# EAGLE design ar1020 (EAGLE 7.3.0)
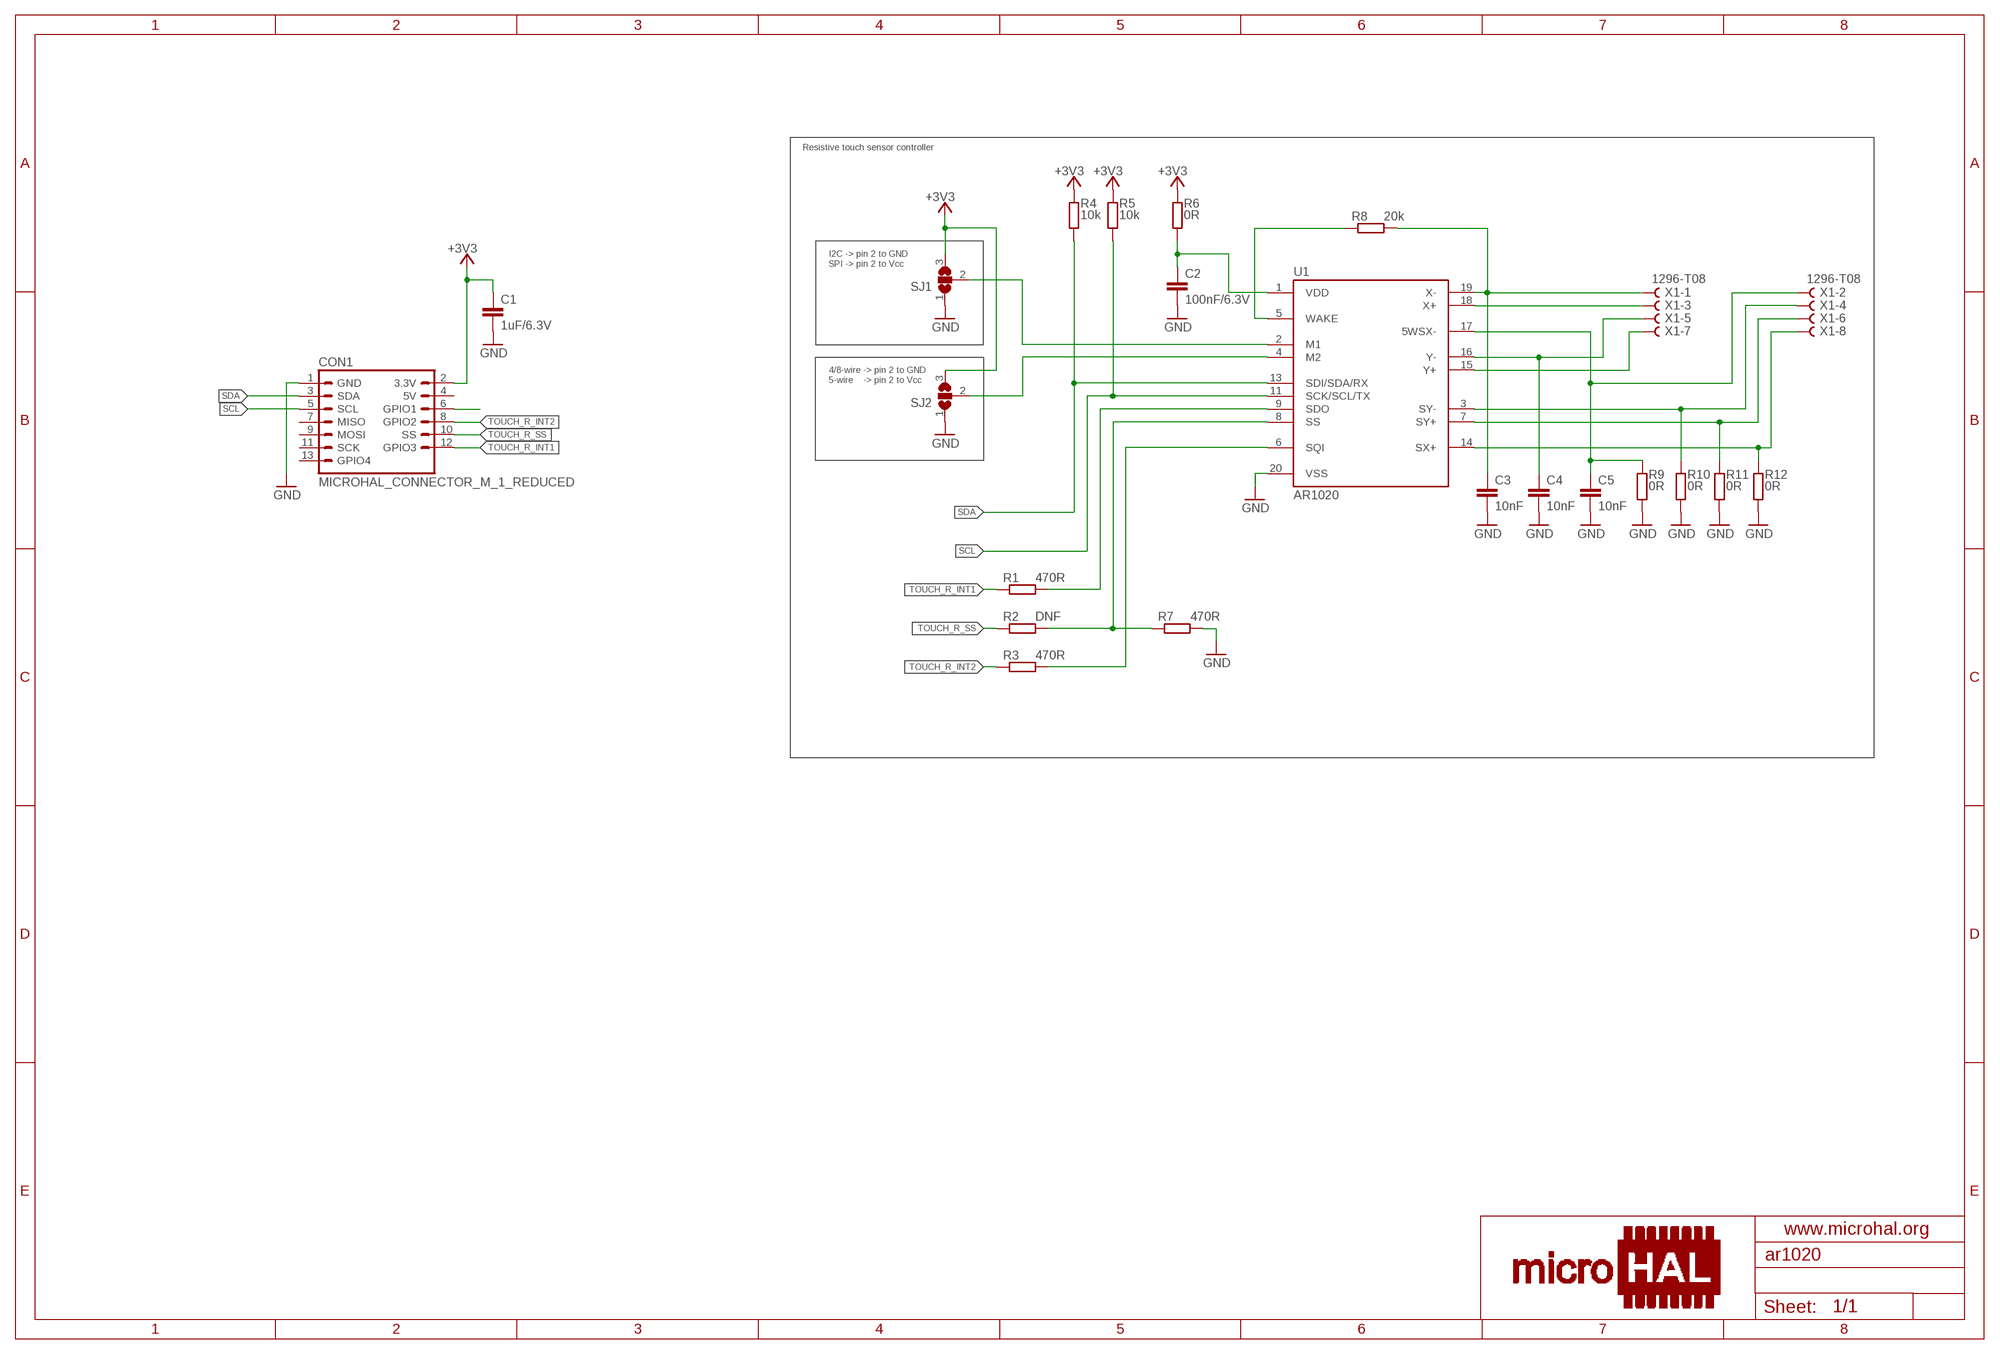
[diagram p0: schematic, sheet 1]

## Parts
C1  1uF/6.3V  C-EUC0603K  [C0603K]
C2  100nF/6.3V  C-EUC0603K  [C0603K]
C3  10nF  C-EUC0603K  [C0603K]
C4  10nF  C-EUC0603K  [C0603K]
C5  10nF  C-EUC0603K  [C0603K]
CON1  MICROHAL_CONNECTOR_M_1_REDUCED  [MICROHAL_CONNECTOR_M_1_REDUCED_EDGE]
R1  470R  R-EU_R0603  [R0603]
R2  DNF  R-EU_R0603  [R0603]
R3  470R  R-EU_R0603  [R0603]
R4  10k  R-EU_R0603  [R0603]
R5  10k  R-EU_R0603  [R0603]
R6  0R  R-EU_R0603  [R0603]
R7  470R  R-EU_R0603  [R0603]
R8  20k  R-EU_R0603  [R0603]
R9  0R  R-EU_R0603  [R0603]
R10  0R  R-EU_R0603  [R0603]
R11  0R  R-EU_R0603  [R0603]
R12  0R  R-EU_R0603  [R0603]
SJ1  SJ2W  [SJ_2]
SJ2  SJ2W  [SJ_2]
U1  AR1020  [SSOP20]
X1  1296-T08  [1296-08]

## Nets
+3V3: C1.1 CON1.2(3.3V) R4.1 R5.1 R6.1 SJ1.3 SJ2.3
GND: C1.2 C2.2 C3.2 C4.2 C5.2 CON1.1(GND) R7.1 R9.2 R10.2 R11.2 R12.2 SJ1.1 SJ2.1 U1.20(VSS)
N$1: SJ1.2 U1.2(M1)
N$2: SJ2.2 U1.4(M2)
N$3: CON1.6(GPIO1)
N$35: C2.1 R6.2 U1.1(VDD)
N$36: R8.2 U1.5(WAKE)
N$37: C3.1 R8.1 U1.19(X-) X1.1
N$38: C4.1 U1.16(Y-) X1.5
N$39: C5.1 R9.1 U1.17(5WSX-) X1.2
N$40: U1.18(X+) X1.3
N$41: U1.15(Y+) X1.7
N$42: R10.1 U1.3(SY-) X1.4
N$43: R11.1 U1.7(SY+) X1.6
N$44: R12.1 U1.14(SX+) X1.8
N$50: R1.1 U1.9(SDO)
N$51: R2.1 R7.2 U1.8(SS)
N$52: R3.1 U1.6(SQI)
SCL: CON1.5(SCL) R5.2 U1.11(SCK/SCL/TX)
SDA: CON1.3(SDA) R4.2 U1.13(SDI/SDA/RX)
TOUCH_R_INT1: CON1.12(GPIO3) R1.2
TOUCH_R_INT2: CON1.8(GPIO2) R3.2
TOUCH_R_SS: CON1.10(SS) R2.2
Unconnected: CON1.4(5V) CON1.7(MISO) CON1.9(MOSI) CON1.11(SCK) CON1.13(GPIO4)

## Notes on the sheet
- Resistive touch sensor controller
- I2C -> pin 2 to GND
  SPI -> pin 2 to Vcc
- 4/8-wire -> pin 2 to GND
  5-wire    -> pin 2 to Vcc

## Library data of the parts
C1-C5 = rcl:C-EU: CAPACITOR, European symbol
CON1 = microhal-connector_v0.1:MICROHAL_CONNECTOR_M_1_REDUCED
R1-R12 = rcl:R-EU_: RESISTOR, European symbol
SJ1 SJ2 = jumper:SJ2W: SMD solder JUMPER
U1 = AR1020:AR1020
X1 = con-leotronics:1296-T08: 1.27mm SINGLE ROW FEMALE SOCKET Source: http://www.leotronics.co.uk/Conexcon/Data%20Sheets/sec.%20A/1296ing.pdf; OC_FARNELL: unknown; OC_NEWARK: unknown

## Board
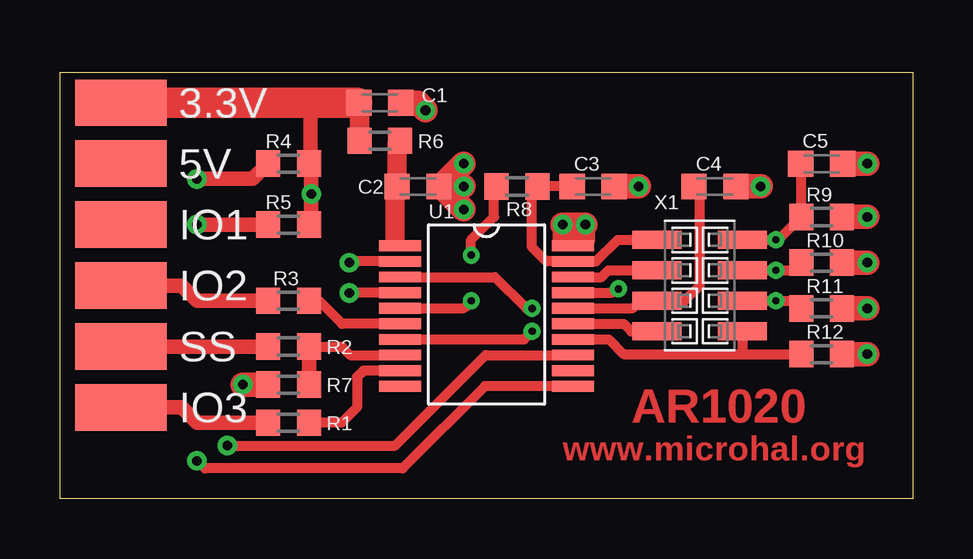
[diagram p1: board, top side]
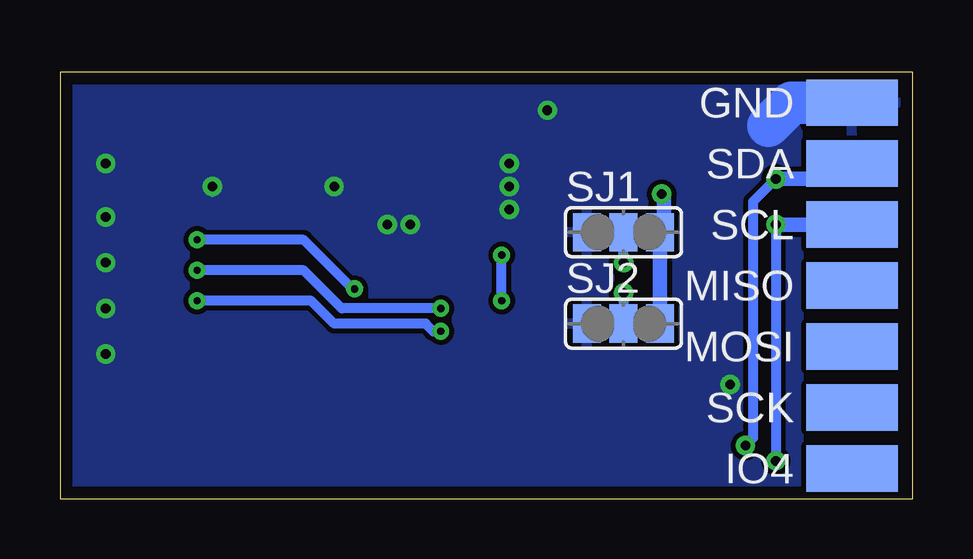
[diagram p2: board, bottom side, seen from below]

Size 35.56 x 17.78 mm. Coordinates in mm from the lower left corner, seen from the top.
Outline: 0,17.78 35.56,17.78 35.56,0 0,0 0,17.78
Copper layers (1*16): Top 0.035mm / dielectric 1.5mm / Bottom 0.035mm
Design rules "default *": minimum track width 8mil, minimum drill 11mil, track to track 8mil, track to pad 6mil, pad to pad 8mil, via to via 8mil, smd to smd 8mil, copper to edge 20mil, drill to drill 8mil, minimum pad ring 10mil, minimum via ring 8mil, stop-mask expansion 4mil, vias tented up to drill 0mil, thermal gap 10mil

### Footprints (pad centres in the part's own frame; a part is rotated, then mirrored left to right if it is on the bottom)
C0603K = smd 1.05 x 1.08: 1 -0.875,0; 2 0.875,0
MICROHAL_CONNECTOR_M_1_REDUCED_EDGE = smd 1.93 x 3.81 bottom: 1 -7.62,0; 3 -5.08,0; 5 -2.54,0; 7 0,0; 9 2.54,0; 11 5.08,0; 13 7.62,0 | smd 1.93 x 3.81: 2 -7.62,0; 4 -5.08,0; 6 -2.54,0; 8 0,0; 10 2.54,0; 12 5.08,0
R0603 = smd 1 x 1.1: 1 -0.85,0; 2 0.85,0
SJ_2 = smd 1.168 x 1.6: 1 -1.524,0; 2 0,0; 3 1.524,0
SSOP20 = smd 0.45 x 1.75: 1 -2.925,-3.6; 2 -2.275,-3.6; 3 -1.625,-3.6; 4 -0.975,-3.6; 5 -0.325,-3.6; 6 0.325,-3.6; 7 0.975,-3.6; 8 1.625,-3.6; 9 2.275,-3.6; 10 2.925,-3.6; 11 2.925,3.6; 12 2.275,3.6; 13 1.625,3.6; 14 0.975,3.6; 15 0.325,3.6; 16 -0.325,3.6; 17 -0.975,3.6; 18 -1.625,3.6; 19 -2.275,3.6; 20 -2.925,3.6
1296-08 = smd 0.76 x 2.05: 1 -1.905,-1.78; 2 -1.905,1.78; 3 -0.635,-1.78; 4 -0.635,1.78; 5 0.635,-1.78; 6 0.635,1.78; 7 1.905,-1.78; 8 1.905,1.78

### Placement (x,y rotation side)
C1  13.34,16.51 0 top
C2  14.92,13.02 0 top
C3  22.23,13.02 0 top
C4  27.3,13.02 0 top
C5  31.75,13.97 0 top
CON1  2.54,8.89 270 top
R1  9.53,3.17 180 top
R2  9.53,6.35 180 top
R3  9.53,8.26 180 top
R4  9.53,13.97 180 top
R5  9.53,11.43 180 top
R6  13.34,14.92 0 top
R7  9.53,4.76 0 top
R8  19.05,13.02 180 top
R9  31.75,11.75 0 top
R10  31.75,9.84 0 top
R11  31.75,7.94 0 top
R12  31.75,6.03 0 top
SJ1  12.06,11.11 0 bottom
SJ2  12.06,7.3 0 bottom
U1  17.78,7.62 270 top
X1  26.67,8.89 270 top

### Tracks (layer width: path | path; a pad name or v marks a point on that pad's centre or on a via)
+3V3  (via drill 0.4)
  Top 0.61: 8.68,16.3 10.45,16.4 | 10.45,16.4 12.38,16.51 | R5.1 10.48,11.53 v10.48,12.7 10.48,13.87 10.45,13.9 | R4.1 10.45,13.9 | 10.45,13.9 10.45,16.4
  Top 0.813: R6.1 12.48,16.48 C1.1
  Top 1.016: 12.38,16.51 C1.1
  Top 1.27: CON1.2 12.38,16.51
  Bottom 0.61: SJ2.3 SJ1.3 10.54,11.26 R5.1 10.38,12.6 v10.48,12.7
GND  (via drill 0.4)
  Top 0.406: v20.95,11.43 20.95,10.97 U1.20
  Top 0.813: v21.91,11.43 21.91,10.79 20.95,10.79 v20.95,11.43
  Top 1.016: C3.2 v24.13,13.02 | v33.66,6.03 R12.2 | v33.66,7.94 R11.2 | v33.66,9.84 R10.2 | v33.66,11.75 R9.2 | v33.66,13.97 C5.2 | v20.95,11.43 v21.91,11.43 | v16.83,13.02 15.88,13.02 | 15.88,13.02 C2.2 | v16.83,13.97 15.88,13.02 | 15.88,13.02 v16.83,12.06 | C4.2 v29.21,13.02 | C1.2 14.92,16.51 v15.24,16.19 | R7.1 v7.62,4.76
  Bottom 0.254: v29.21,13.02 29.21,12.7
  Bottom 1.778: CON1.1 5.08,16.51 6.03,15.56
  pour Bottom: 35.56,0 35.56,17.78 0,17.78 0,0
N$1  (via drill 0.4)
  Top 0.406: U1.2 12.12,9.89 v12.06,9.84
  Bottom 0.406: v12.06,9.84 SJ1.2
N$2  (via drill 0.4)
  Top 0.406: U1.4 12.36,8.6 v12.06,8.57
  Bottom 0.406: v12.06,8.57 SJ2.2
N$35
  Top 0.406: U1.1 14.18,10.59 13.97,10.79
  Top 0.813: 13.97,10.79 13.97,12.94 C2.1 14.05,14.79 R6.2
N$36  (via drill 0.3)
  Top 0.406: U1.5 16.84,7.95 v17.14,8.26 | v17.14,10.16 17.14,10.79 18.1,11.75 18.1,12.91 R8.2
  Bottom 0.406: v17.14,8.26 v17.14,10.16
N$37
  Top 0.406: 24.84,10.84 X1.1 23.25,10.79 22.35,9.89 U1.19 20.27,9.89 19.68,10.48 19.68,12.8 R8.1 C3.1
N$38
  Top 0.406: U1.16 23.88,7.95 24.19,8.26 X1.5 26.04,8.26 26.67,8.89 26.67,12.78 C4.1
N$39  (via drill 0.3)
  Top 0.406: 28.45,10.92 X1.2 v29.84,10.79 29.95,10.79 R9.1 30.9,13.95 C5.1 | U1.17 23.03,8.6 v23.28,8.75
  Bottom 0.406: v23.28,8.75 23.43,8.83 25.4,10.79 v29.84,10.79
N$40
  Top 0.406: U1.18 22.58,9.24 22.86,9.53 X1.3
N$41
  Top 0.406: U1.15 23.5,7.29 23.81,6.99 X1.7
N$42  (via drill 0.3)
  Top 0.406: X1.4 v29.84,9.53 30.58,9.53 R10.1 | U1.3 18.14,9.24 19.44,7.94 v19.68,7.94
  Bottom 0.406: v19.68,7.94 23.81,7.94 25.4,9.53 v29.84,9.53
N$43  (via drill 0.3)
  Top 0.406: X1.6 v29.84,8.26 30.58,8.26 R11.1 | U1.7 19.34,6.64 v19.68,6.99
  Bottom 0.406: v19.68,6.99 20,6.99 20.32,7.3 24.13,7.3 25.08,8.26 v29.84,8.26
N$44
  Top 0.406: U1.14 22.88,6.64 23.5,6.03 28.57,6.03 | 27.62,6.99 X1.8 28.45,6.16 28.57,6.03 | 28.57,6.03 R12.1
N$50
  Top 0.406: U1.9 12.65,5.34 12.38,5.08 12.38,3.81 11.75,3.17 R1.1
N$51
  Top 0.406: R2.1 11.75,6.35 12.1,6 U1.8
  Top 0.61: R7.2 R2.1
N$52
  Top 0.406: U1.6 11.76,7.29 10.79,8.26 R3.1
SCL  (via drill 0.4)
  Top 0.406: U1.11 17.71,4.7 14.29,1.27 6.03,1.27 v5.71,1.59
  Top 0.61: R5.2 v5.71,11.43
  Bottom 0.406: v5.71,11.43 v5.71,1.59
  Bottom 0.61: 3.17,10.79 CON1.5 v5.71,11.43
SDA  (via drill 0.4)
  Top 0.406: v6.99,2.22 13.97,2.22 17.74,6 U1.13
  Top 0.61: R4.2 8.04,13.34 v5.71,13.34
  Bottom 0.406: v5.71,13.34 6.67,12.38 6.67,2.54 v6.99,2.22
  Bottom 0.61: v5.71,13.34 3.17,13.34 CON1.3
TOUCH_R_INT1
  Top 0.61: R1.2 5.71,3.17 5.08,3.81 CON1.12
TOUCH_R_INT2
  Top 0.61: R3.2 5.71,8.26 5.08,8.89 CON1.8
TOUCH_R_SS
  Top 0.61: R2.2 CON1.10

### Text on the board
Top: AR1020 | www.microhal.org
tStop: AR1020 | www.microhal.org